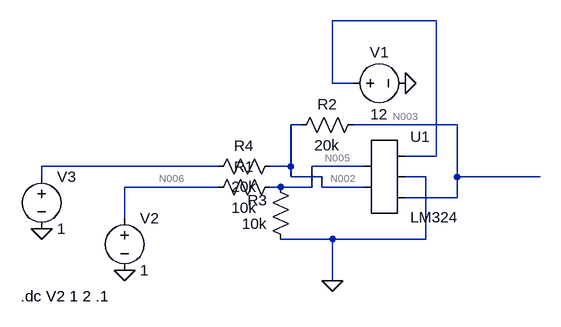
[diagram p0: schematic difference_amp_test.asc]
* difference_amp_test.asc
V1 N001 0 12
V2 N006 0 1
V3 N004 0 1
R1 N005 N006 10k
R3 0 N005 10k
R4 N002 N004 20k
R2 N003 N002 20k
* U1: LM324 (symbol AutoGenerated\LM324 not available, pins judged from their places): pin1=N005 pin2=N002 pin3=N001 pin4=0 pin5=N003
.dc V2 1 2 .1
.backanno
.end

* Results of the author's LTspice run, read from the files saved beside the schematic
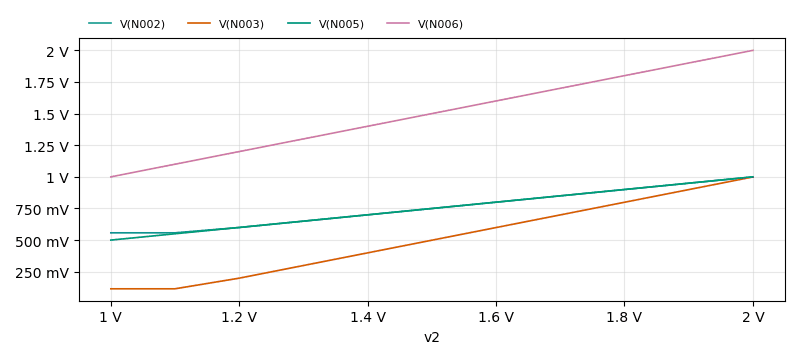
[diagram p1: DC transfer characteristic of difference_amp_test.asc, plotted from the saved traces]
* DC transfer characteristic, 1 run:
*   V(N002): 557.6 mV at v2=1 V, 999.7 mV at v2=2 V, min 557.6 mV, max 999.7 mV
*   V(N003): 115 mV at v2=1 V, 999.2 mV at v2=2 V, min 115 mV, max 999.2 mV
*   V(N005): 500.1 mV at v2=1 V, 1 V at v2=2 V, min 500.1 mV, max 1 V
*   V(N006): 1 V at v2=1 V, 2 V at v2=2 V, min 1 V, max 2 V